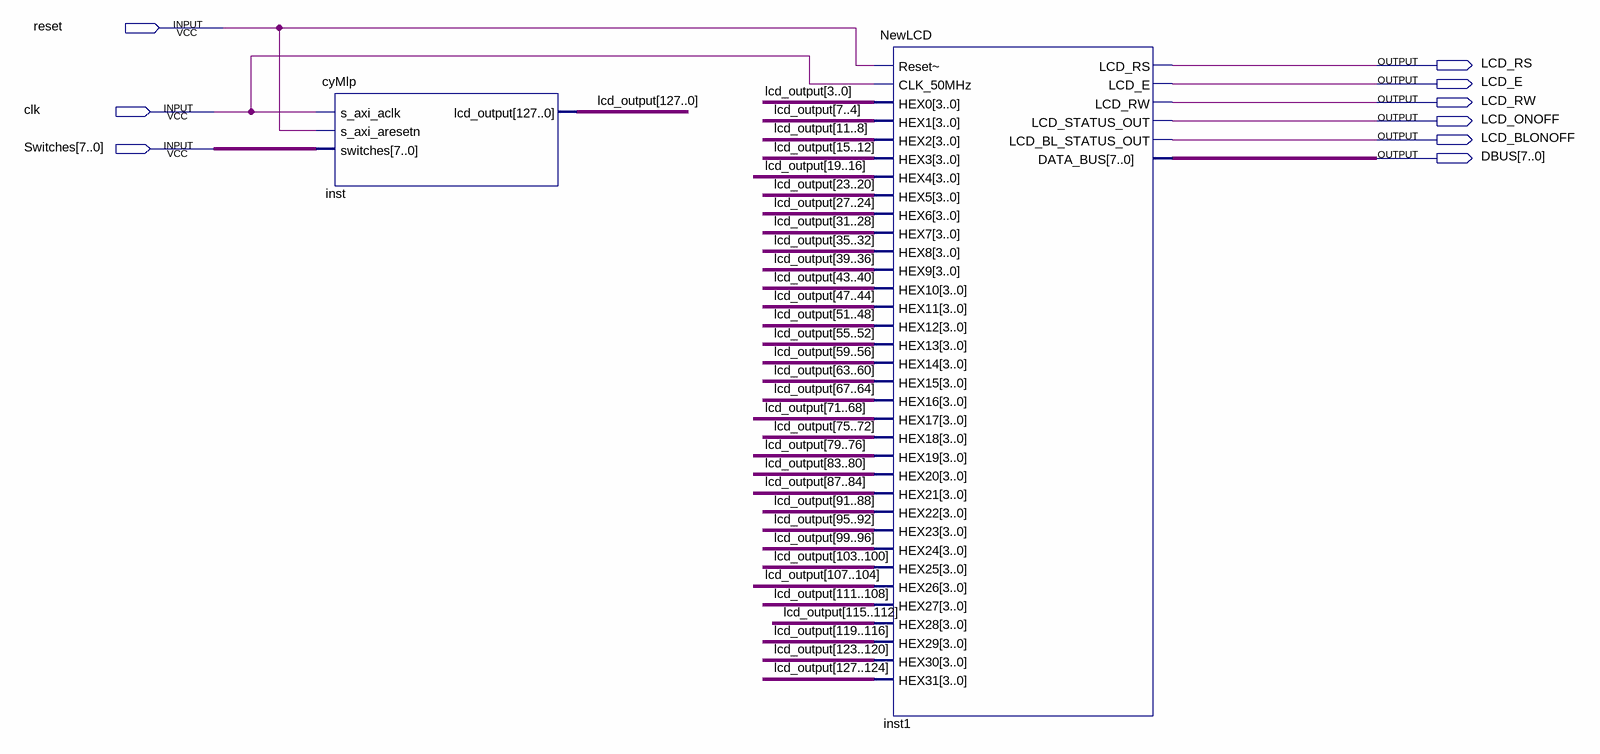
[diagram p0: schematic sheet]
// Quartus schematic cyMlpLCD.bdf as structural Verilog: 2 symbols, 9 pins
module cyMlpLCD (
  input  reset,
  input  clk,
  input  [7:0] Switches,
  output LCD_RS,
  output LCD_E,
  output LCD_RW,
  output LCD_ONOFF,
  output LCD_BLONOFF,
  output [7:0] DBUS
);

  wire [127:0] lcd_output;

  cyMlp inst (.s_axi_aclk(clk), .s_axi_aresetn(reset), .switches(Switches), .lcd_output(lcd_output));
  NewLCD inst1 (
    .\Reset~ (reset), .CLK_50MHz(clk), .HEX0(lcd_output[3:0]), .HEX1(lcd_output[7:4]),
    .HEX2(lcd_output[11:8]), .HEX3(lcd_output[15:12]), .HEX4(lcd_output[19:16]), .HEX5(lcd_output[23:20]),
    .HEX6(lcd_output[27:24]), .HEX7(lcd_output[31:28]), .HEX8(lcd_output[35:32]), .HEX9(lcd_output[39:36]),
    .HEX10(lcd_output[43:40]), .HEX11(lcd_output[47:44]), .HEX12(lcd_output[51:48]),
    .HEX13(lcd_output[55:52]), .HEX14(lcd_output[59:56]), .HEX15(lcd_output[63:60]),
    .HEX16(lcd_output[67:64]), .HEX17(lcd_output[71:68]), .HEX18(lcd_output[75:72]),
    .HEX19(lcd_output[79:76]), .HEX20(lcd_output[83:80]), .HEX21(lcd_output[87:84]),
    .HEX22(lcd_output[91:88]), .HEX23(lcd_output[95:92]), .HEX24(lcd_output[99:96]),
    .HEX25(lcd_output[103:100]), .HEX26(lcd_output[107:104]), .HEX27(lcd_output[111:108]),
    .HEX28(lcd_output[115:112]), .HEX29(lcd_output[119:116]), .HEX30(lcd_output[123:120]),
    .HEX31(lcd_output[127:124]), .LCD_RS(LCD_RS), .LCD_E(LCD_E), .LCD_RW(LCD_RW), .LCD_STATUS_OUT(LCD_ONOFF),
    .LCD_BL_STATUS_OUT(LCD_BLONOFF), .DATA_BUS(DBUS));
endmodule
